# EasyEDA schematic SCH_HackPack_2024-05-12.json
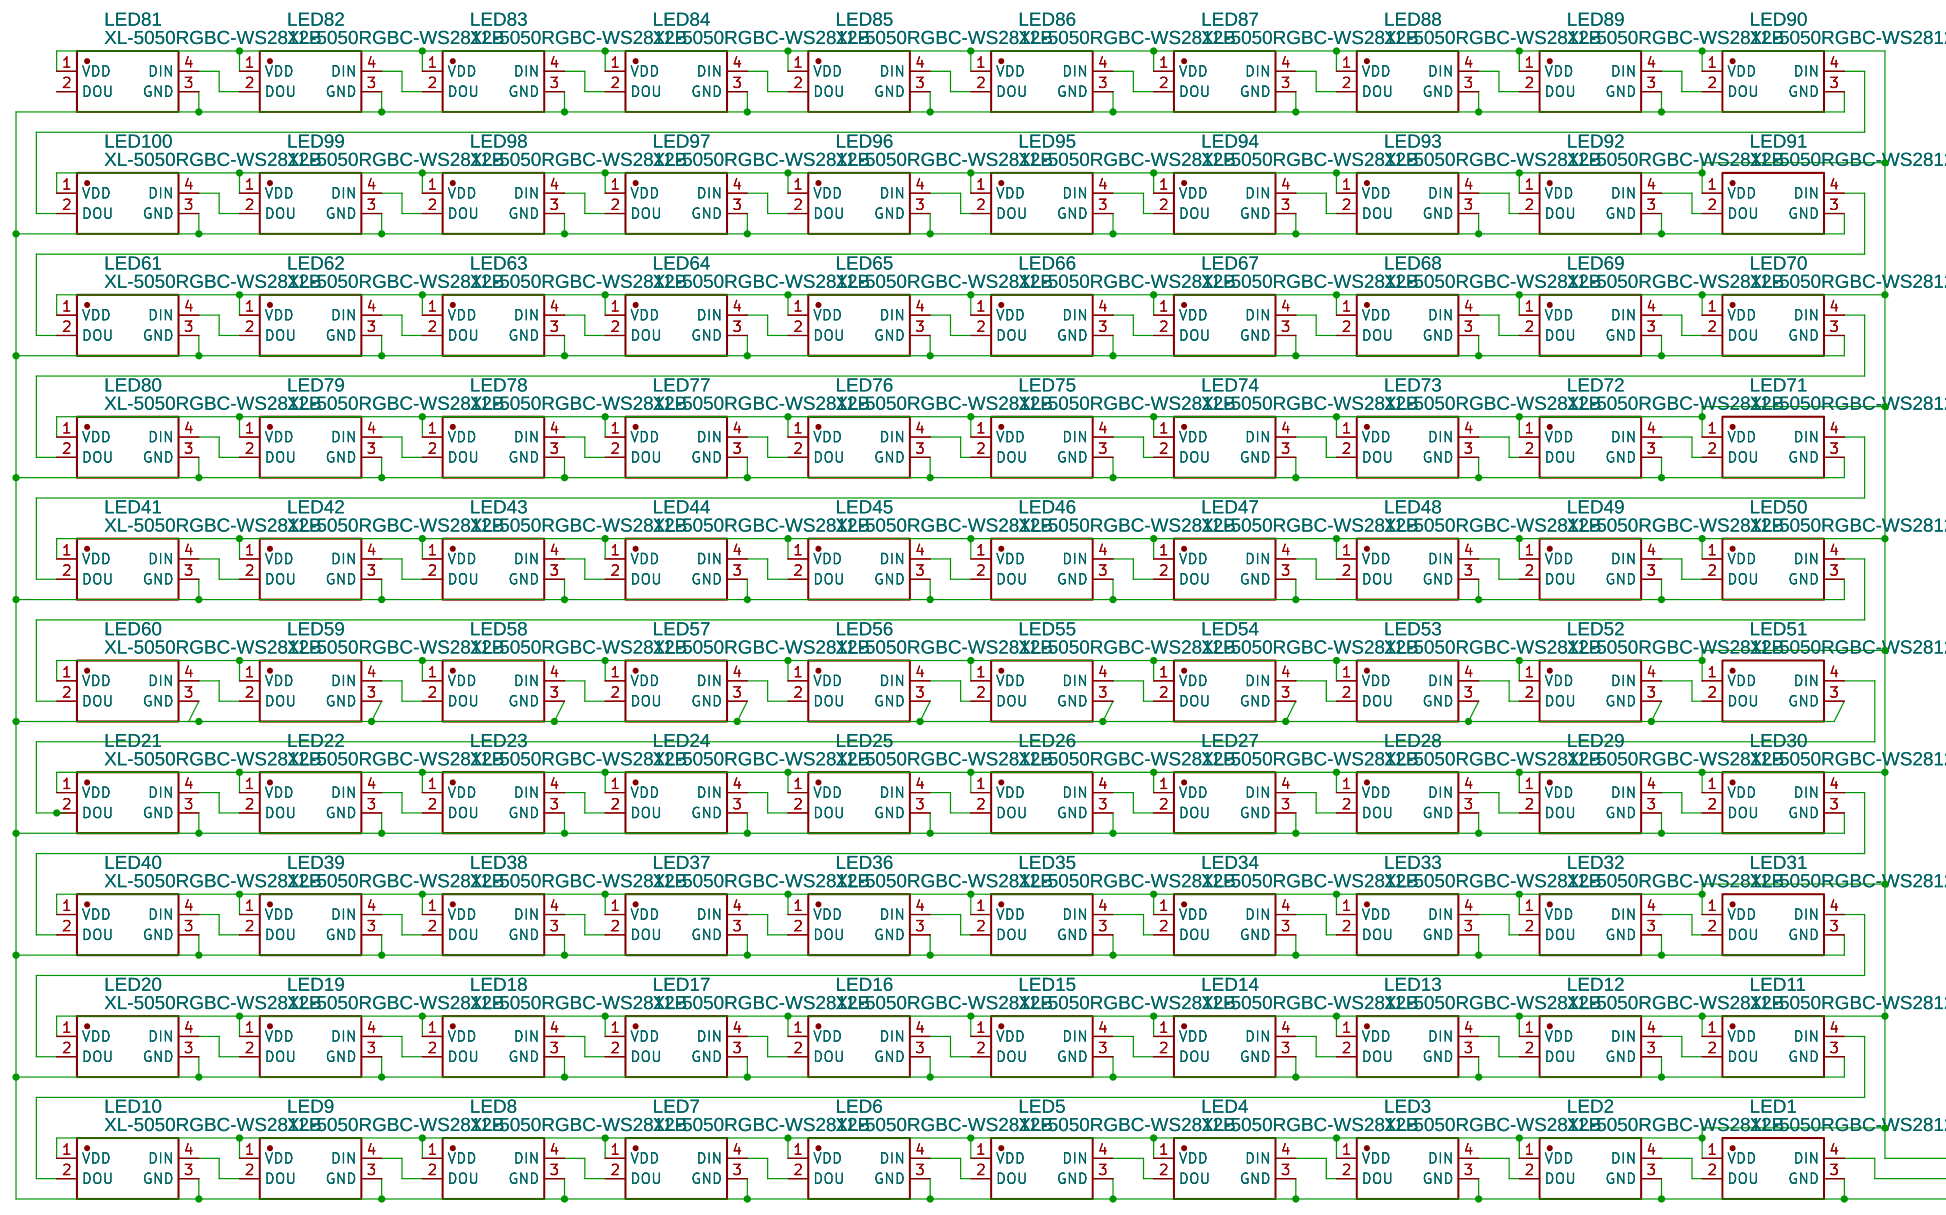
[diagram p0: schematic sheet]

## Parts
LED1  XL-5050RGBC-WS2812B  [LED-SMD_4P-L5.0-W5.0-BL_XL-5050RGBC]
LED2  XL-5050RGBC-WS2812B  [LED-SMD_4P-L5.0-W5.0-BL_XL-5050RGBC]
LED3  XL-5050RGBC-WS2812B  [LED-SMD_4P-L5.0-W5.0-BL_XL-5050RGBC]
LED4  XL-5050RGBC-WS2812B  [LED-SMD_4P-L5.0-W5.0-BL_XL-5050RGBC]
LED5  XL-5050RGBC-WS2812B  [LED-SMD_4P-L5.0-W5.0-BL_XL-5050RGBC]
LED6  XL-5050RGBC-WS2812B  [LED-SMD_4P-L5.0-W5.0-BL_XL-5050RGBC]
LED7  XL-5050RGBC-WS2812B  [LED-SMD_4P-L5.0-W5.0-BL_XL-5050RGBC]
LED8  XL-5050RGBC-WS2812B  [LED-SMD_4P-L5.0-W5.0-BL_XL-5050RGBC]
LED9  XL-5050RGBC-WS2812B  [LED-SMD_4P-L5.0-W5.0-BL_XL-5050RGBC]
LED10  XL-5050RGBC-WS2812B  [LED-SMD_4P-L5.0-W5.0-BL_XL-5050RGBC]
LED11  XL-5050RGBC-WS2812B  [LED-SMD_4P-L5.0-W5.0-BL_XL-5050RGBC]
LED12  XL-5050RGBC-WS2812B  [LED-SMD_4P-L5.0-W5.0-BL_XL-5050RGBC]
LED13  XL-5050RGBC-WS2812B  [LED-SMD_4P-L5.0-W5.0-BL_XL-5050RGBC]
LED14  XL-5050RGBC-WS2812B  [LED-SMD_4P-L5.0-W5.0-BL_XL-5050RGBC]
LED15  XL-5050RGBC-WS2812B  [LED-SMD_4P-L5.0-W5.0-BL_XL-5050RGBC]
LED16  XL-5050RGBC-WS2812B  [LED-SMD_4P-L5.0-W5.0-BL_XL-5050RGBC]
LED17  XL-5050RGBC-WS2812B  [LED-SMD_4P-L5.0-W5.0-BL_XL-5050RGBC]
LED18  XL-5050RGBC-WS2812B  [LED-SMD_4P-L5.0-W5.0-BL_XL-5050RGBC]
LED19  XL-5050RGBC-WS2812B  [LED-SMD_4P-L5.0-W5.0-BL_XL-5050RGBC]
LED20  XL-5050RGBC-WS2812B  [LED-SMD_4P-L5.0-W5.0-BL_XL-5050RGBC]
LED21  XL-5050RGBC-WS2812B  [LED-SMD_4P-L5.0-W5.0-BL_XL-5050RGBC]
LED22  XL-5050RGBC-WS2812B  [LED-SMD_4P-L5.0-W5.0-BL_XL-5050RGBC]
LED23  XL-5050RGBC-WS2812B  [LED-SMD_4P-L5.0-W5.0-BL_XL-5050RGBC]
LED24  XL-5050RGBC-WS2812B  [LED-SMD_4P-L5.0-W5.0-BL_XL-5050RGBC]
LED25  XL-5050RGBC-WS2812B  [LED-SMD_4P-L5.0-W5.0-BL_XL-5050RGBC]
LED26  XL-5050RGBC-WS2812B  [LED-SMD_4P-L5.0-W5.0-BL_XL-5050RGBC]
LED27  XL-5050RGBC-WS2812B  [LED-SMD_4P-L5.0-W5.0-BL_XL-5050RGBC]
LED28  XL-5050RGBC-WS2812B  [LED-SMD_4P-L5.0-W5.0-BL_XL-5050RGBC]
LED29  XL-5050RGBC-WS2812B  [LED-SMD_4P-L5.0-W5.0-BL_XL-5050RGBC]
LED30  XL-5050RGBC-WS2812B  [LED-SMD_4P-L5.0-W5.0-BL_XL-5050RGBC]
LED31  XL-5050RGBC-WS2812B  [LED-SMD_4P-L5.0-W5.0-BL_XL-5050RGBC]
LED32  XL-5050RGBC-WS2812B  [LED-SMD_4P-L5.0-W5.0-BL_XL-5050RGBC]
LED33  XL-5050RGBC-WS2812B  [LED-SMD_4P-L5.0-W5.0-BL_XL-5050RGBC]
LED34  XL-5050RGBC-WS2812B  [LED-SMD_4P-L5.0-W5.0-BL_XL-5050RGBC]
LED35  XL-5050RGBC-WS2812B  [LED-SMD_4P-L5.0-W5.0-BL_XL-5050RGBC]
LED36  XL-5050RGBC-WS2812B  [LED-SMD_4P-L5.0-W5.0-BL_XL-5050RGBC]
LED37  XL-5050RGBC-WS2812B  [LED-SMD_4P-L5.0-W5.0-BL_XL-5050RGBC]
LED38  XL-5050RGBC-WS2812B  [LED-SMD_4P-L5.0-W5.0-BL_XL-5050RGBC]
LED39  XL-5050RGBC-WS2812B  [LED-SMD_4P-L5.0-W5.0-BL_XL-5050RGBC]
LED40  XL-5050RGBC-WS2812B  [LED-SMD_4P-L5.0-W5.0-BL_XL-5050RGBC]
LED41  XL-5050RGBC-WS2812B  [LED-SMD_4P-L5.0-W5.0-BL_XL-5050RGBC]
LED42  XL-5050RGBC-WS2812B  [LED-SMD_4P-L5.0-W5.0-BL_XL-5050RGBC]
LED43  XL-5050RGBC-WS2812B  [LED-SMD_4P-L5.0-W5.0-BL_XL-5050RGBC]
LED44  XL-5050RGBC-WS2812B  [LED-SMD_4P-L5.0-W5.0-BL_XL-5050RGBC]
LED45  XL-5050RGBC-WS2812B  [LED-SMD_4P-L5.0-W5.0-BL_XL-5050RGBC]
LED46  XL-5050RGBC-WS2812B  [LED-SMD_4P-L5.0-W5.0-BL_XL-5050RGBC]
LED47  XL-5050RGBC-WS2812B  [LED-SMD_4P-L5.0-W5.0-BL_XL-5050RGBC]
LED48  XL-5050RGBC-WS2812B  [LED-SMD_4P-L5.0-W5.0-BL_XL-5050RGBC]
LED49  XL-5050RGBC-WS2812B  [LED-SMD_4P-L5.0-W5.0-BL_XL-5050RGBC]
LED50  XL-5050RGBC-WS2812B  [LED-SMD_4P-L5.0-W5.0-BL_XL-5050RGBC]
LED51  XL-5050RGBC-WS2812B  [LED-SMD_4P-L5.0-W5.0-BL_XL-5050RGBC]
LED52  XL-5050RGBC-WS2812B  [LED-SMD_4P-L5.0-W5.0-BL_XL-5050RGBC]
LED53  XL-5050RGBC-WS2812B  [LED-SMD_4P-L5.0-W5.0-BL_XL-5050RGBC]
LED54  XL-5050RGBC-WS2812B  [LED-SMD_4P-L5.0-W5.0-BL_XL-5050RGBC]
LED55  XL-5050RGBC-WS2812B  [LED-SMD_4P-L5.0-W5.0-BL_XL-5050RGBC]
LED56  XL-5050RGBC-WS2812B  [LED-SMD_4P-L5.0-W5.0-BL_XL-5050RGBC]
LED57  XL-5050RGBC-WS2812B  [LED-SMD_4P-L5.0-W5.0-BL_XL-5050RGBC]
LED58  XL-5050RGBC-WS2812B  [LED-SMD_4P-L5.0-W5.0-BL_XL-5050RGBC]
LED59  XL-5050RGBC-WS2812B  [LED-SMD_4P-L5.0-W5.0-BL_XL-5050RGBC]
LED60  XL-5050RGBC-WS2812B  [LED-SMD_4P-L5.0-W5.0-BL_XL-5050RGBC]
LED61  XL-5050RGBC-WS2812B  [LED-SMD_4P-L5.0-W5.0-BL_XL-5050RGBC]
LED62  XL-5050RGBC-WS2812B  [LED-SMD_4P-L5.0-W5.0-BL_XL-5050RGBC]
LED63  XL-5050RGBC-WS2812B  [LED-SMD_4P-L5.0-W5.0-BL_XL-5050RGBC]
LED64  XL-5050RGBC-WS2812B  [LED-SMD_4P-L5.0-W5.0-BL_XL-5050RGBC]
LED65  XL-5050RGBC-WS2812B  [LED-SMD_4P-L5.0-W5.0-BL_XL-5050RGBC]
LED66  XL-5050RGBC-WS2812B  [LED-SMD_4P-L5.0-W5.0-BL_XL-5050RGBC]
LED67  XL-5050RGBC-WS2812B  [LED-SMD_4P-L5.0-W5.0-BL_XL-5050RGBC]
LED68  XL-5050RGBC-WS2812B  [LED-SMD_4P-L5.0-W5.0-BL_XL-5050RGBC]
LED69  XL-5050RGBC-WS2812B  [LED-SMD_4P-L5.0-W5.0-BL_XL-5050RGBC]
LED70  XL-5050RGBC-WS2812B  [LED-SMD_4P-L5.0-W5.0-BL_XL-5050RGBC]
LED71  XL-5050RGBC-WS2812B  [LED-SMD_4P-L5.0-W5.0-BL_XL-5050RGBC]
LED72  XL-5050RGBC-WS2812B  [LED-SMD_4P-L5.0-W5.0-BL_XL-5050RGBC]
LED73  XL-5050RGBC-WS2812B  [LED-SMD_4P-L5.0-W5.0-BL_XL-5050RGBC]
LED74  XL-5050RGBC-WS2812B  [LED-SMD_4P-L5.0-W5.0-BL_XL-5050RGBC]
LED75  XL-5050RGBC-WS2812B  [LED-SMD_4P-L5.0-W5.0-BL_XL-5050RGBC]
LED76  XL-5050RGBC-WS2812B  [LED-SMD_4P-L5.0-W5.0-BL_XL-5050RGBC]
LED77  XL-5050RGBC-WS2812B  [LED-SMD_4P-L5.0-W5.0-BL_XL-5050RGBC]
LED78  XL-5050RGBC-WS2812B  [LED-SMD_4P-L5.0-W5.0-BL_XL-5050RGBC]
LED79  XL-5050RGBC-WS2812B  [LED-SMD_4P-L5.0-W5.0-BL_XL-5050RGBC]
LED80  XL-5050RGBC-WS2812B  [LED-SMD_4P-L5.0-W5.0-BL_XL-5050RGBC]
LED81  XL-5050RGBC-WS2812B  [LED-SMD_4P-L5.0-W5.0-BL_XL-5050RGBC]
LED82  XL-5050RGBC-WS2812B  [LED-SMD_4P-L5.0-W5.0-BL_XL-5050RGBC]
LED83  XL-5050RGBC-WS2812B  [LED-SMD_4P-L5.0-W5.0-BL_XL-5050RGBC]
LED84  XL-5050RGBC-WS2812B  [LED-SMD_4P-L5.0-W5.0-BL_XL-5050RGBC]
LED85  XL-5050RGBC-WS2812B  [LED-SMD_4P-L5.0-W5.0-BL_XL-5050RGBC]
LED86  XL-5050RGBC-WS2812B  [LED-SMD_4P-L5.0-W5.0-BL_XL-5050RGBC]
LED87  XL-5050RGBC-WS2812B  [LED-SMD_4P-L5.0-W5.0-BL_XL-5050RGBC]
LED88  XL-5050RGBC-WS2812B  [LED-SMD_4P-L5.0-W5.0-BL_XL-5050RGBC]
LED89  XL-5050RGBC-WS2812B  [LED-SMD_4P-L5.0-W5.0-BL_XL-5050RGBC]
LED90  XL-5050RGBC-WS2812B  [LED-SMD_4P-L5.0-W5.0-BL_XL-5050RGBC]
LED91  XL-5050RGBC-WS2812B  [LED-SMD_4P-L5.0-W5.0-BL_XL-5050RGBC]
LED92  XL-5050RGBC-WS2812B  [LED-SMD_4P-L5.0-W5.0-BL_XL-5050RGBC]
LED93  XL-5050RGBC-WS2812B  [LED-SMD_4P-L5.0-W5.0-BL_XL-5050RGBC]
LED94  XL-5050RGBC-WS2812B  [LED-SMD_4P-L5.0-W5.0-BL_XL-5050RGBC]
LED95  XL-5050RGBC-WS2812B  [LED-SMD_4P-L5.0-W5.0-BL_XL-5050RGBC]
LED96  XL-5050RGBC-WS2812B  [LED-SMD_4P-L5.0-W5.0-BL_XL-5050RGBC]
LED97  XL-5050RGBC-WS2812B  [LED-SMD_4P-L5.0-W5.0-BL_XL-5050RGBC]
LED98  XL-5050RGBC-WS2812B  [LED-SMD_4P-L5.0-W5.0-BL_XL-5050RGBC]
LED99  XL-5050RGBC-WS2812B  [LED-SMD_4P-L5.0-W5.0-BL_XL-5050RGBC]
LED100  XL-5050RGBC-WS2812B  [LED-SMD_4P-L5.0-W5.0-BL_XL-5050RGBC]

## Library data of the parts
LED1-LED100 = XL-5050RGBC-WS2812B: Contributor: LCSC; Supplier: LCSC; Supplier Part: C2843785; Manufacturer: XINGLIGHT(成兴光); JLCPCB Part Class: Extended Part

## Nets
Net-(LED1-1): LED1.1(VDD) LED2.1(VDD) LED3.1(VDD) LED4.1(VDD) LED5.1(VDD) LED6.1(VDD) LED7.1(VDD) LED8.1(VDD) LED9.1(VDD) LED10.1(VDD) LED11.1(VDD) LED12.1(VDD) LED13.1(VDD) LED14.1(VDD) LED15.1(VDD) LED16.1(VDD) LED17.1(VDD) LED18.1(VDD) LED19.1(VDD) LED20.1(VDD) LED21.1(VDD) LED22.1(VDD) LED23.1(VDD) LED24.1(VDD) LED25.1(VDD) LED26.1(VDD) LED27.1(VDD) LED28.1(VDD) LED29.1(VDD) LED30.1(VDD) LED31.1(VDD) LED32.1(VDD) LED33.1(VDD) LED34.1(VDD) LED35.1(VDD) LED36.1(VDD) LED37.1(VDD) LED38.1(VDD) LED39.1(VDD) LED40.1(VDD) LED41.1(VDD) LED42.1(VDD) LED43.1(VDD) LED44.1(VDD) LED45.1(VDD) LED46.1(VDD) LED47.1(VDD) LED48.1(VDD) LED49.1(VDD) LED50.1(VDD) LED51.1(VDD) LED52.1(VDD) LED53.1(VDD) LED54.1(VDD) LED55.1(VDD) LED56.1(VDD) LED57.1(VDD) LED58.1(VDD) LED59.1(VDD) LED60.1(VDD) LED61.1(VDD) LED62.1(VDD) LED63.1(VDD) LED64.1(VDD) LED65.1(VDD) LED66.1(VDD) LED67.1(VDD) LED68.1(VDD) LED69.1(VDD) LED70.1(VDD) LED71.1(VDD) LED72.1(VDD) LED73.1(VDD) LED74.1(VDD) LED75.1(VDD) LED76.1(VDD) LED77.1(VDD) LED78.1(VDD) LED79.1(VDD) LED80.1(VDD) LED81.1(VDD) LED82.1(VDD) LED83.1(VDD) LED84.1(VDD) LED85.1(VDD) LED86.1(VDD) LED87.1(VDD) LED88.1(VDD) LED89.1(VDD) LED90.1(VDD) LED91.1(VDD) LED92.1(VDD) LED93.1(VDD) LED94.1(VDD) LED95.1(VDD) LED96.1(VDD) LED97.1(VDD) LED98.1(VDD) LED99.1(VDD) LED100.1(VDD)
Net-(LED1-2): LED1.2(DOU) LED2.4(DIN)
Net-(LED1-3): LED1.3(GND) LED2.3(GND) LED3.3(GND) LED4.3(GND) LED5.3(GND) LED6.3(GND) LED7.3(GND) LED8.3(GND) LED9.3(GND) LED10.3(GND) LED11.3(GND) LED12.3(GND) LED13.3(GND) LED14.3(GND) LED15.3(GND) LED16.3(GND) LED17.3(GND) LED18.3(GND) LED19.3(GND) LED20.3(GND) LED21.3(GND) LED22.3(GND) LED23.3(GND) LED24.3(GND) LED25.3(GND) LED26.3(GND) LED27.3(GND) LED28.3(GND) LED29.3(GND) LED30.3(GND) LED31.3(GND) LED32.3(GND) LED33.3(GND) LED34.3(GND) LED35.3(GND) LED36.3(GND) LED37.3(GND) LED38.3(GND) LED39.3(GND) LED40.3(GND) LED41.3(GND) LED42.3(GND) LED43.3(GND) LED44.3(GND) LED45.3(GND) LED46.3(GND) LED47.3(GND) LED48.3(GND) LED49.3(GND) LED50.3(GND) LED51.3(GND) LED52.3(GND) LED53.3(GND) LED54.3(GND) LED55.3(GND) LED56.3(GND) LED57.3(GND) LED58.3(GND) LED59.3(GND) LED60.3(GND) LED61.3(GND) LED62.3(GND) LED63.3(GND) LED64.3(GND) LED65.3(GND) LED66.3(GND) LED67.3(GND) LED68.3(GND) LED69.3(GND) LED70.3(GND) LED71.3(GND) LED72.3(GND) LED73.3(GND) LED74.3(GND) LED75.3(GND) LED76.3(GND) LED77.3(GND) LED78.3(GND) LED79.3(GND) LED80.3(GND) LED81.3(GND) LED82.3(GND) LED83.3(GND) LED84.3(GND) LED85.3(GND) LED86.3(GND) LED87.3(GND) LED88.3(GND) LED89.3(GND) LED90.3(GND) LED91.3(GND) LED92.3(GND) LED93.3(GND) LED94.3(GND) LED95.3(GND) LED96.3(GND) LED97.3(GND) LED98.3(GND) LED99.3(GND) LED100.3(GND)
Net-(LED2-2): LED2.2(DOU) LED3.4(DIN)
Net-(LED3-2): LED3.2(DOU) LED4.4(DIN)
Net-(LED4-2): LED4.2(DOU) LED5.4(DIN)
Net-(LED5-2): LED5.2(DOU) LED6.4(DIN)
Net-(LED6-2): LED6.2(DOU) LED7.4(DIN)
Net-(LED7-2): LED7.2(DOU) LED8.4(DIN)
Net-(LED8-2): LED8.2(DOU) LED9.4(DIN)
Net-(LED9-2): LED9.2(DOU) LED10.4(DIN)
Net-(LED10-2): LED10.2(DOU) LED11.4(DIN)
Net-(LED11-2): LED11.2(DOU) LED12.4(DIN)
Net-(LED12-2): LED12.2(DOU) LED13.4(DIN)
Net-(LED13-2): LED13.2(DOU) LED14.4(DIN)
Net-(LED14-2): LED14.2(DOU) LED15.4(DIN)
Net-(LED15-2): LED15.2(DOU) LED16.4(DIN)
Net-(LED16-2): LED16.2(DOU) LED17.4(DIN)
Net-(LED17-2): LED17.2(DOU) LED18.4(DIN)
Net-(LED18-2): LED18.2(DOU) LED19.4(DIN)
Net-(LED19-2): LED19.2(DOU) LED20.4(DIN)
Net-(LED20-2): LED20.2(DOU) LED31.4(DIN)
Net-(LED21-2): LED21.2(DOU) LED51.4(DIN)
Net-(LED21-4): LED21.4(DIN) LED22.2(DOU)
Net-(LED22-4): LED22.4(DIN) LED23.2(DOU)
Net-(LED23-4): LED23.4(DIN) LED24.2(DOU)
Net-(LED24-4): LED24.4(DIN) LED25.2(DOU)
Net-(LED25-4): LED25.4(DIN) LED26.2(DOU)
Net-(LED26-4): LED26.4(DIN) LED27.2(DOU)
Net-(LED27-4): LED27.4(DIN) LED28.2(DOU)
Net-(LED28-4): LED28.4(DIN) LED29.2(DOU)
Net-(LED29-4): LED29.4(DIN) LED30.2(DOU)
Net-(LED30-4): LED30.4(DIN) LED40.2(DOU)
Net-(LED31-2): LED31.2(DOU) LED32.4(DIN)
Net-(LED32-2): LED32.2(DOU) LED33.4(DIN)
Net-(LED33-2): LED33.2(DOU) LED34.4(DIN)
Net-(LED34-2): LED34.2(DOU) LED35.4(DIN)
Net-(LED35-2): LED35.2(DOU) LED36.4(DIN)
Net-(LED36-2): LED36.2(DOU) LED37.4(DIN)
Net-(LED37-2): LED37.2(DOU) LED38.4(DIN)
Net-(LED38-2): LED38.2(DOU) LED39.4(DIN)
Net-(LED39-2): LED39.2(DOU) LED40.4(DIN)
Net-(LED41-2): LED41.2(DOU) LED71.4(DIN)
Net-(LED41-4): LED41.4(DIN) LED42.2(DOU)
Net-(LED42-4): LED42.4(DIN) LED43.2(DOU)
Net-(LED43-4): LED43.4(DIN) LED44.2(DOU)
Net-(LED44-4): LED44.4(DIN) LED45.2(DOU)
Net-(LED45-4): LED45.4(DIN) LED46.2(DOU)
Net-(LED46-4): LED46.4(DIN) LED47.2(DOU)
Net-(LED47-4): LED47.4(DIN) LED48.2(DOU)
Net-(LED48-4): LED48.4(DIN) LED49.2(DOU)
Net-(LED49-4): LED49.4(DIN) LED50.2(DOU)
Net-(LED50-4): LED50.4(DIN) LED60.2(DOU)
Net-(LED51-2): LED51.2(DOU) LED52.4(DIN)
Net-(LED52-2): LED52.2(DOU) LED53.4(DIN)
Net-(LED53-2): LED53.2(DOU) LED54.4(DIN)
Net-(LED54-2): LED54.2(DOU) LED55.4(DIN)
Net-(LED55-2): LED55.2(DOU) LED56.4(DIN)
Net-(LED56-2): LED56.2(DOU) LED57.4(DIN)
Net-(LED57-2): LED57.2(DOU) LED58.4(DIN)
Net-(LED58-2): LED58.2(DOU) LED59.4(DIN)
Net-(LED59-2): LED59.2(DOU) LED60.4(DIN)
Net-(LED61-2): LED61.2(DOU) LED91.4(DIN)
Net-(LED61-4): LED61.4(DIN) LED62.2(DOU)
Net-(LED62-4): LED62.4(DIN) LED63.2(DOU)
Net-(LED63-4): LED63.4(DIN) LED64.2(DOU)
Net-(LED64-4): LED64.4(DIN) LED65.2(DOU)
Net-(LED65-4): LED65.4(DIN) LED66.2(DOU)
Net-(LED66-4): LED66.4(DIN) LED67.2(DOU)
Net-(LED67-4): LED67.4(DIN) LED68.2(DOU)
Net-(LED68-4): LED68.4(DIN) LED69.2(DOU)
Net-(LED69-4): LED69.4(DIN) LED70.2(DOU)
Net-(LED70-4): LED70.4(DIN) LED80.2(DOU)
Net-(LED71-2): LED71.2(DOU) LED72.4(DIN)
Net-(LED72-2): LED72.2(DOU) LED73.4(DIN)
Net-(LED73-2): LED73.2(DOU) LED74.4(DIN)
Net-(LED74-2): LED74.2(DOU) LED75.4(DIN)
Net-(LED75-2): LED75.2(DOU) LED76.4(DIN)
Net-(LED76-2): LED76.2(DOU) LED77.4(DIN)
Net-(LED77-2): LED77.2(DOU) LED78.4(DIN)
Net-(LED78-2): LED78.2(DOU) LED79.4(DIN)
Net-(LED79-2): LED79.2(DOU) LED80.4(DIN)
Net-(LED81-4): LED81.4(DIN) LED82.2(DOU)
Net-(LED82-4): LED82.4(DIN) LED83.2(DOU)
Net-(LED83-4): LED83.4(DIN) LED84.2(DOU)
Net-(LED84-4): LED84.4(DIN) LED85.2(DOU)
Net-(LED85-4): LED85.4(DIN) LED86.2(DOU)
Net-(LED86-4): LED86.4(DIN) LED87.2(DOU)
Net-(LED87-4): LED87.4(DIN) LED88.2(DOU)
Net-(LED88-4): LED88.4(DIN) LED89.2(DOU)
Net-(LED89-4): LED89.4(DIN) LED90.2(DOU)
Net-(LED90-4): LED90.4(DIN) LED100.2(DOU)
Net-(LED91-2): LED91.2(DOU) LED92.4(DIN)
Net-(LED92-2): LED92.2(DOU) LED93.4(DIN)
Net-(LED93-2): LED93.2(DOU) LED94.4(DIN)
Net-(LED94-2): LED94.2(DOU) LED95.4(DIN)
Net-(LED95-2): LED95.2(DOU) LED96.4(DIN)
Net-(LED96-2): LED96.2(DOU) LED97.4(DIN)
Net-(LED97-2): LED97.2(DOU) LED98.4(DIN)
Net-(LED98-2): LED98.2(DOU) LED99.4(DIN)
Net-(LED99-2): LED99.2(DOU) LED100.4(DIN)

Not connected (* = marked no-connect by the designer): LED1 4(DIN); LED81 2(DOU)
